# EAGLE design Touch Switch (EAGLE 6.2)
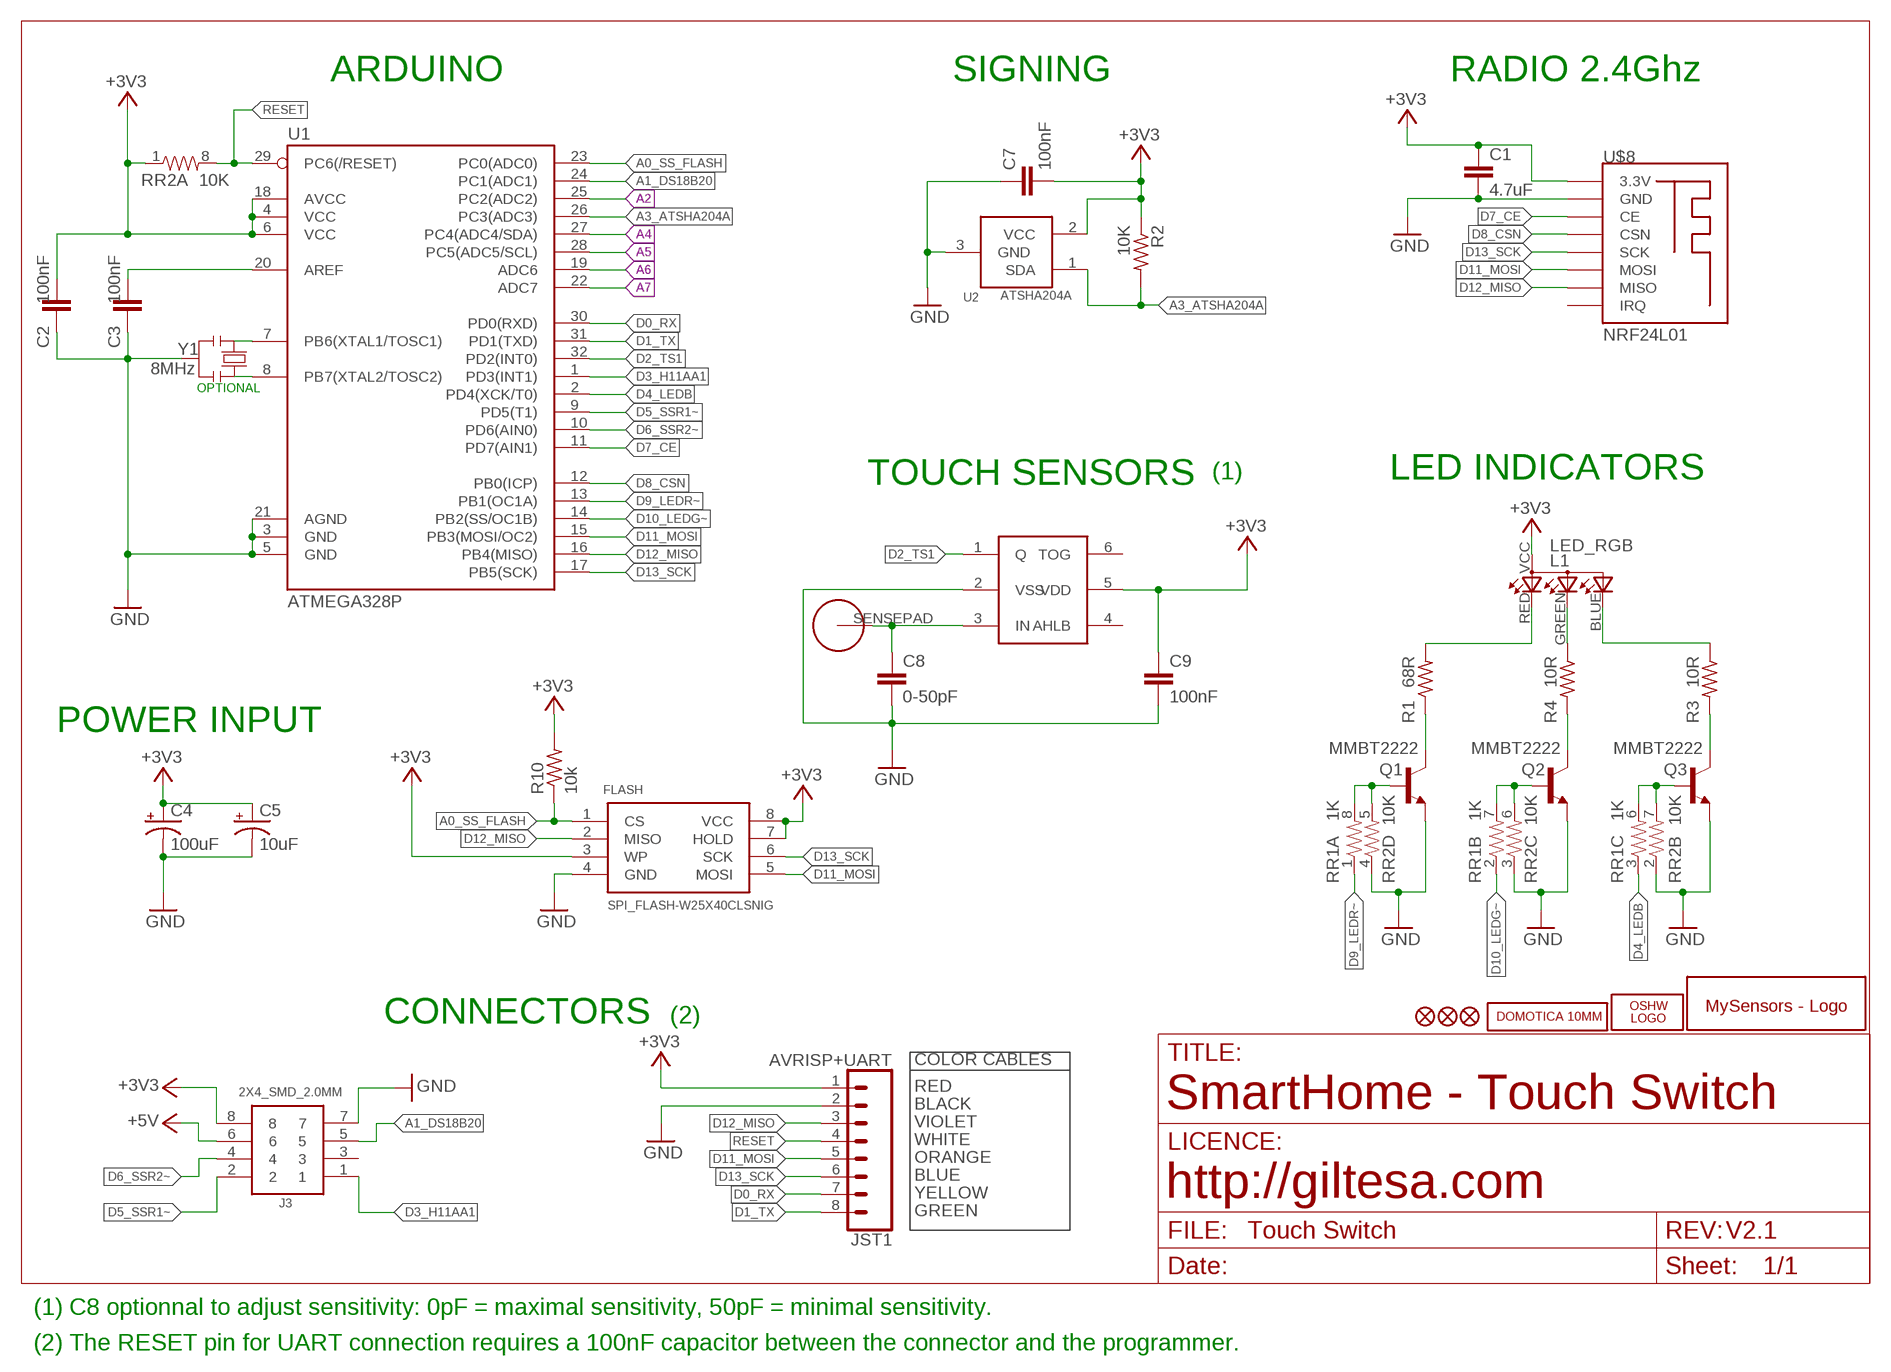
[diagram p0: schematic, sheet 1]

## Parts
C1  4.7uF  C1206  [C1206]
C2  100nF  C0603  [C0603]
C3  100nF  C0603  [C0603]
C4  100uF  10UF-16V-10%(TANT)  [EIA3216]
C5  10uF  10UF-16V-10%(TANT)  [EIA3216]
C7  100nF  C0603  [C0603]
C8  0-50pF  C0603  [C0603]
C9  100nF  C0603  [C0603]
FLASH  SPI_FLASH-W25X40CLSNIG  SPI_FLASH-X25XXSMD  [SO08]
J3  2X4_SMD_2.0MM  [2X4_SMD_2.0MM]
JST1  AVRISP+UART  JST-8-1MM-SMD  [JST-8-1MM-SMD]
L1  LED_RGB  LED_RGB_1206_SIDE  [LED_RGB_1206_SIDE]
LOGO1  OSHW_LOGO_FILLX0150-NT  [OSHW_FILLX150_NOTEXT]
Q1  MMBT2222  TRANSISTOR_NPNSOT23  [SOT23]
Q2  MMBT2222  TRANSISTOR_NPNSOT23  [SOT23]
Q3  MMBT2222  TRANSISTOR_NPNSOT23  [SOT23]
R1  68R  R0603  [R0603]
R2  10K  R0603  [R0603]
R3  10R  R0603  [R0603]
R4  10R  R0603  [R0603]
R10  10k  R0603  [R0603]
RR1  1K  RESISTOR-ARRAY0603-ARV  [0603-ARV]
RR2  10K  RESISTOR-ARRAY0603-ARV  [0603-ARV]
TTP1  TTP223  TTP223-BA6  [SOT-23-6]
U1  ATMEGA328P  ATMEGA328P_TQFP  [TQFP32-08]
U2  ATSHA204A  IC_ATSHA204A_CRYPT  [SOT23-3]
U$1  HTTM_SENSEPAD  [HTTM_SENSEPAD]
U$2  MYSENSORS  [MYSENSORS]
U$5  DOMOTICA-10MM  [DOMOTICA-10MM]
U$6  FIDUCIAL1X2  [FIDUCIAL-1X2]
U$7  FIDUCIAL1X2  [FIDUCIAL-1X2]
U$8  NRF24L01  NRF24L01_SMD  [NRF24L01_SMD]
U$14  FIDUCIAL1X2  [FIDUCIAL-1X2]
Y1  8MHz  RESONATORMU  [RESONATOR]

## Nets
+3V3: C1.1 C2.2 C4.A(+) C5.A(+) C7.2 C9.1 FLASH.3(WP) FLASH.7(HOLD) FLASH.8(VCC) J3.8 JST1.1 L1.VCC R2.1 R10.2 RR2.1 TTP1.5(VDD) U1.4(VCC) U1.6(VCC) U1.18(AVCC) U2.2(VCC) U$8.3.3V
+5V: J3.6
A0_SS_FLASH: FLASH.1(CS) R10.1 U1.23(PC0(ADC0))
A1_DS18B20: J3.5 U1.24(PC1(ADC1))
A2: U1.25(PC2(ADC2))
A3_ATSHA204A: R2.2 U1.26(PC3(ADC3)) U2.1(SDA)
A4: U1.27(PC4(ADC4/SDA))
A5: U1.28(PC5(ADC5/SCL))
A6: U1.19(ADC6)
A7: U1.22(ADC7)
D0_RX: JST1.7 U1.30(PD0(RXD))
D1_TX: JST1.8 U1.31(PD1(TXD))
D2_TS1: TTP1.1(Q) U1.32(PD2(INT0))
D3_H11AA1: J3.1 U1.1(PD3(INT1))
D4_LEDB: RR1.3 U1.2(PD4(XCK/T0))
D5_SSR1~: J3.2 U1.9(PD5(T1))
D6_SSR2~: J3.4 U1.10(PD6(AIN0))
D7_CE: U1.11(PD7(AIN1)) U$8.CE
D8_CSN: U1.12(PB0(ICP)) U$8.CSN
D9_LEDR~: RR1.1 U1.13(PB1(OC1A))
D10_LEDG~: RR1.2 U1.14(PB2(SS/OC1B))
D11_MOSI: FLASH.5(MOSI) JST1.5 U1.15(PB3(MOSI/OC2)) U$8.MOSI
D12_MISO: FLASH.2(MISO) JST1.3 U1.16(PB4(MISO)) U$8.MISO
D13_SCK: FLASH.6(SCK) JST1.6 U1.17(PB5(SCK)) U$8.SCK
GND: C1.2 C2.1 C3.1 C4.C(-) C5.C(-) C7.1 C8.2 C9.2 FLASH.4(GND) J3.7 JST1.2 Q1.2(E) Q2.2(E) Q3.2(E) RR2.2 RR2.3 RR2.4 TTP1.2(VSS) U1.3(GND) U1.5(GND) U1.21(AGND) U2.3(GND) U$8.GND Y1.2
N$1: Q1.3(C) R1.1
N$2: L1.GREEN R4.1
N$4: L1.RED R1.2
N$5: Q2.1(B) RR1.7 RR2.6
N$6: Q1.1(B) RR1.8 RR2.5
N$7: Q2.3(C) R4.2
N$8: Q3.3(C) R3.2
N$9: Q3.1(B) RR1.6 RR2.7
N$10: C8.1 TTP1.3(IN) U$1.SENSEPAD
N$11: L1.BLUE R3.1
N$29: U1.7(PB6(XTAL1/TOSC1)) Y1.1
N$30: U1.8(PB7(XTAL2/TOSC2)) Y1.3
N$33: C3.2 U1.20(AREF)
RESET: JST1.4 RR2.8 U1.29(PC6(/RESET))
Unconnected: J3.3 RR1.4 RR1.5 TTP1.4(AHLB) TTP1.6(TOG) U$8.IRQ

## Notes on the sheet
- ARDUINO | SIGNING | RADIO 2.4Ghz
- OPTIONAL
- TOUCH SENSORS | (1) | LED INDICATORS
- POWER INPUT
- CONNECTORS | (2)
- COLOR CABLES
- RED
- BLACK | SmartHome - Touch Switch
- VIOLET
- WHITE
- ORANGE
- BLUE
- YELLOW | http://giltesa.com
- GREEN
- V2.1
- (1) C8 optionnal to adjust sensitivity: 0pF = maximal sensitivity, 50pF = minimal sensitivity.
- (2) The RESET pin for UART connection requires a 100nF capacitor between the connector and the programmer.

## Library data of the parts
C1 = ,giltesa:C1206
C2 C3 C7-C9 = ,giltesa:C0603
C4 = SparkFun-Capacitors:10UF-16V-10%(TANT): CAP-00811 1206/EIA-3216 Tantalum capacitor; PROD_ID: CAP-00811; VALUE: 10uF
C5 = SparkFun-Capacitors:10UF-16V-10%(TANT): CAP-00811 1206/EIA-3216 Tantalum capacitor; PROD_ID: CAP-00811
FLASH = SparkFun-DigitalIC:SPI_FLASH-X25XX: 8pin SPI Flash series x25xx. Works with devices like W25X32 and BR25L32
J3 = ,giltesa:2X4_SMD_2.0MM
JST1 = ,giltesa:JST-8-1MM-SMD
L1 = ,giltesa:LED_RGB_1206_SIDE
LOGO1 = ohw-logo:OSHW_LOGO_FILL
Q1-Q3 = SparkFun:TRANSISTOR_NPN: Transistor NPN BJT configuration in SOT23 package. MMBT2222 is the common NPN we use. Double check BCE configuration again layout.
R1-R4 R10 = ,giltesa:R0603
RR1 RR2 = SparkFun-Passives:RESISTOR-ARRAY: Array Chip Resistor Source: RS Component / Phycomp
TTP1 = NCA_Sensors:TTP223-BA6: TTP223 touch sensor
U1 = SparkFun-DigitalIC:ATMEGA328P_TQFP; PROD_ID: IC-09069; VALUE: ATMEGA328P_TQFP
U2 = TD-MySensors:IC_ATSHA204A_CRYPT
U$1 = ,giltesa:HTTM_SENSEPAD
U$2 = ,giltesa_logos:MYSENSORS
U$5 = ,giltesa_logos:DOMOTICA-10MM
U$6 U$7 U$14 = SparkFun:FIDUCIAL: Fiducial Alignment Points Various fiducial points for machine vision alignment.
U$8 = ,giltesa:NRF24L01_SMD
Y1 = MySMD2:RESONATOR

## Net classes
1 POWER: width 0.457 mm, clearance 0.205 mm to class 0, clearance 0.254 mm

## Board
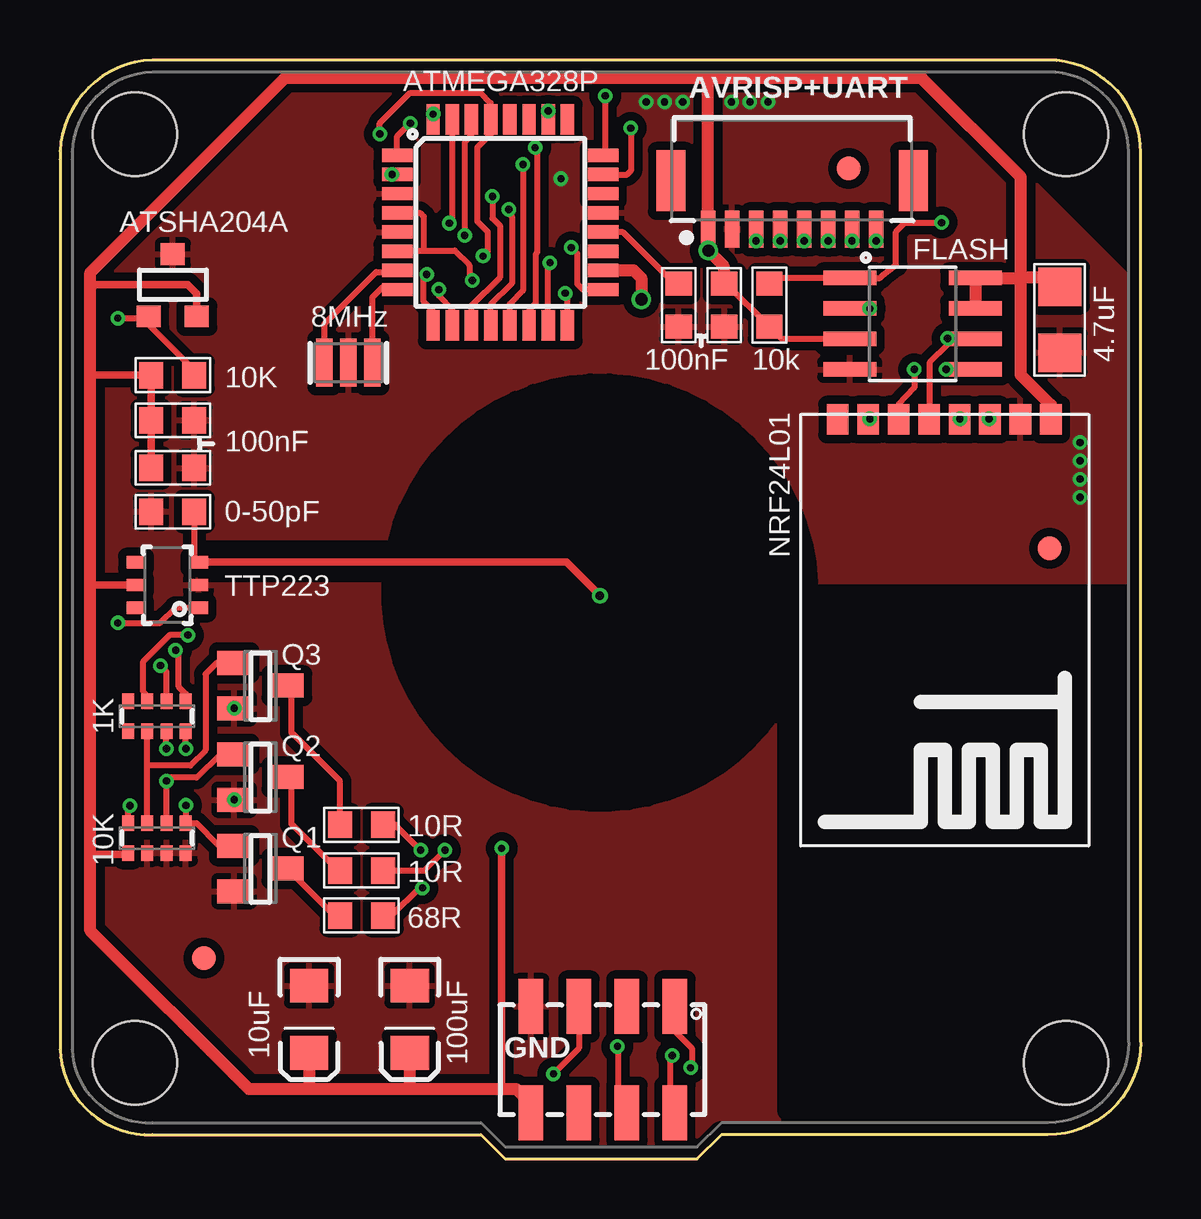
[diagram p1: board, top side]
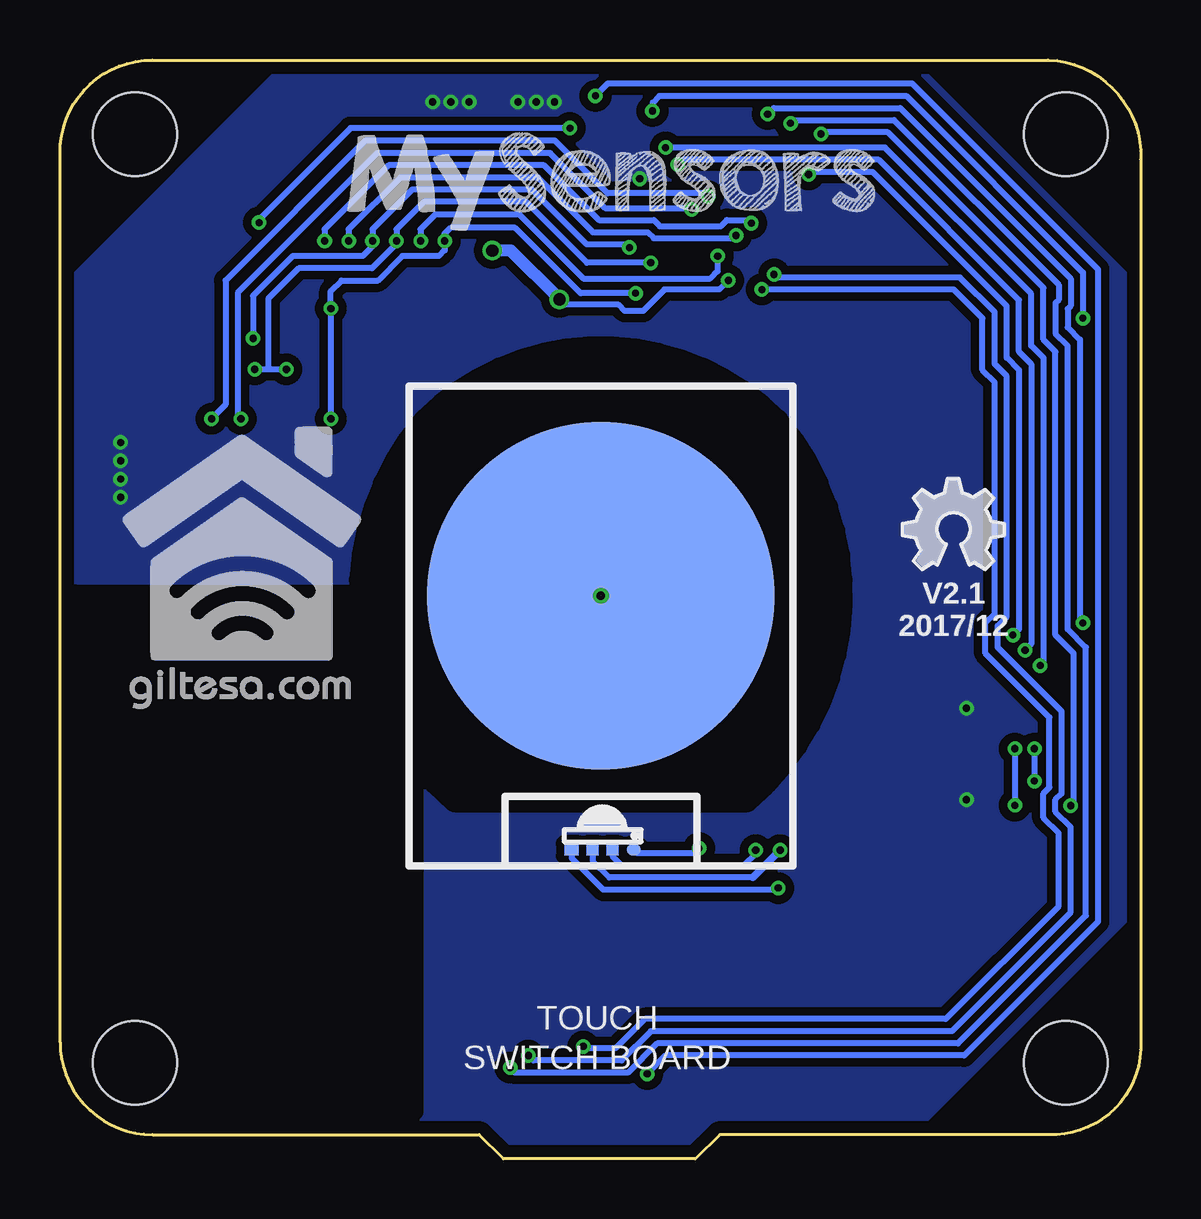
[diagram p2: board, bottom side, seen from below]

Size 45.05 x 45.81 mm. Coordinates in mm from the lower left corner, seen from the top.
Outline: 18.56,0 26.56,0 27.58,1.02 41.19,1.02 arc90 45.05,4.87 45.05,41.96 arc90 41.19,45.81 3.86,45.81 arc90 0,41.66 0,4.57 arc90 3.86,1.02 17.55,1.02 18.56,0
Copper layers (1*16): Top 0.035mm / dielectric 1.6mm / Bottom 0.035mm
Design rules "default *": minimum track width 6mil, minimum drill 0.3mm, track to track 6mil, track to pad 6mil, pad to pad 6mil, via to via 8mil, smd to smd 0mil, copper to edge 20mil, drill to drill 10mil, minimum pad ring 6mil, minimum via ring 6mil, stop-mask expansion 0mil, vias tented up to drill 100mil, thermal gap 10mil
Holes 3.5 mm at 3.12,4.01 41.93,42.72 3.12,42.72 41.93,4.01
tRestrict: area 13.9,14.9 to 31.1,32.3; area 6.1,24.4 to 13.8,25.4; area 30.3,2 to 44.4,23.5
bRestrict: area 12.5,14.9 to 32.6,33.8; area 30.3,2 to 44.4,23.5

### Footprints (pad centres in the part's own frame; a part is rotated, then mirrored left to right if it is on the bottom)
C1206 = smd 1.6 x 1.8: 1 -1.362,-0.013; 2 1.387,-0.013
C0603 = smd 1 x 1.1: 1 -0.901,-0.038; 2 0.901,-0.038
EIA3216 = smd 1.4 x 1.6: A 1.4,0; C -1.4,0
SO08 = smd 0.61 x 2.21: 1 -1.905,-2.616; 2 -0.635,-2.616; 3 0.635,-2.616; 4 1.905,-2.616; 5 1.905,2.616; 6 0.635,2.616; 7 -0.635,2.616; 8 -1.905,2.616
2X4_SMD_2.0MM = smd 2.286 x 1.016: 1 -2.213,2.976; 2 2.212,2.976; 3 -2.213,0.976; 4 2.212,0.976; 5 -2.213,-1.024; 6 2.212,-1.024; 7 -2.213,-3.024; 8 2.212,-3.024
JST-8-1MM-SMD = smd 0.6 x 1.55: 1 -3.5,0; 2 -2.5,0; 3 -1.5,0; 4 -0.5,0; 5 0.5,0; 6 1.5,0; 7 2.5,0; 8 3.5,0 | smd 1.219 x 2.54: P$9 5.054,2.017; P$10 -5.054,2.017
LED_RGB_1206_SIDE = smd 0.5 x 0.5: BLUE -0.419,-0.83; GREEN 0.414,-0.83 | smd 0.6 x 0.5: RED -1.296,-0.83; VCC 1.295,-0.83
SOT23 = smd 1 x 1.4: 1 -0.95,-1.1; 2 0.95,-1.1; 3 0,1.1
R0603 = smd 1 x 1.1: 1 -0.901,0.013; 2 0.901,0.013
0603-ARV = smd 0.5 x 0.65: 1 -1.2,-0.625; 2 -0.4,-0.625; 3 0.4,-0.625; 4 1.2,-0.625; 5 1.2,0.625; 6 0.4,0.625; 7 -0.4,0.625; 8 -1.2,0.625
SOT-23-6 = smd 0.51 x 0.8: 1 0.955,-0.03; 2 1.905,-0.03; 3 2.855,-0.03; 4 2.855,2.57; 5 1.905,2.57; 6 0.955,2.57
TQFP32-08 = smd 1.27 x 0.559: 1 -4.293,2.8; 2 -4.293,2; 3 -4.293,1.2; 4 -4.293,0.4; 5 -4.293,-0.4; 6 -4.293,-1.2; 7 -4.293,-2; 8 -4.293,-2.8; 17 4.293,-2.8; 18 4.293,-2; 19 4.293,-1.2; 20 4.293,-0.4; 21 4.293,0.4; 22 4.293,1.2; 23 4.293,2; 24 4.293,2.8 | smd 0.559 x 1.27: 9 -2.8,-4.293; 10 -2,-4.293; 11 -1.2,-4.293; 12 -0.4,-4.293; 13 0.4,-4.293; 14 1.2,-4.293; 15 2,-4.293; 16 2.8,-4.293; 25 2.8,4.293; 26 2,4.293; 27 1.2,4.293; 28 0.4,4.293; 29 -0.4,4.293; 30 -1.2,4.293; 31 -2,4.293; 32 -2.8,4.293
SOT23-3 = smd 1 x 0.9: 1 -1,-1.3; 2 1,-1.3; 3 0,1.3
HTTM_SENSEPAD = smd 14.5 x 14.5: SENSEPAD -0.001,0.001
FIDUCIAL-1X2 = smd 1 x 1: 1 0,0
NRF24L01_SMD = smd 0.9 x 1.27: 3.3V 1.575,0.203; CE 4.115,0.203; CSN 5.385,0.203; GND 2.845,0.203; IRQ 10.465,0.203; MISO 9.195,0.203; MOSI 7.925,0.203; SCK 6.655,0.203
RESONATOR = smd 0.7 x 2: 1 -1,0; 2 0,0; 3 1,0

### Placement (x,y rotation side)
C1  41.69,35 270 top
C2  27.65,35.59 90 top
C3  25.75,35.59 90 top
C4  14.58,5.83 270 top
C5  10.38,5.83 270 top
C7  4.7,30.75 180 top
C8  4.7,26.94 180 top
C9  4.7,28.85 0 top
FLASH  35.54,34.82 270 top
J3  22.66,4.15 270 top
JST1  30.52,38.76 0 top
L1  22.43,13.73 0 bottom
LOGO1  9.93,24.56 0 bottom
Q1  8.36,12.11 270 top
Q2  8.36,15.92 270 top
Q3  8.36,19.73 270 top
R1  12.57,10.14 0 top
R2  4.7,32.66 0 top
R3  12.57,13.95 180 top
R4  12.57,12.04 180 top
R10  29.56,35.59 270 top
RR1  4.04,18.46 180 top
RR2  4.04,13.38 0 top
TTP1  5.74,22.02 90 top
U1  18.35,39.04 0 top
U2  4.7,36.42 0 top
U$1  22.5,23.48 0 bottom
U$2  33.05,38.5 0 bottom
U$5  42.46,18.69 0 bottom
U$6  41.25,25.45 0 top
U$7  32.87,41.3 0 top
U$8  42.88,31.03 180 top
U$14  6,8.38 0 top
Y1  12.02,33.19 0 top

### Tracks (layer width: path | path; a pad name or v marks a point on that pad's centre or on a via)
+3V3  (via drill 0.3, 0.51)
  Top 0.254: U1.6 14.09,37.87 15.16,37.87 | v17.19,36.62 17.06,36.75 17.06,37.26 16.45,37.87 15.16,37.87 | U1.4 15.01,39.44 15.16,39.29 15.16,37.87 | C2.2 27.77,36.49 R10.2 | 29.95,34.31 R10.2 | FLASH.3 30.08,34.18 R10.2
  Top 0.305: RR2.1 2.78,12.7 1.27,12.7 | TTP1.5 1.34,23.93 1.27,24 | C9.1 C7.2 R2.1 1.35,32.67 1.27,32.76 | U2.2 5.7,36.07 5.33,36.44 1.39,36.44 1.27,36.32 | v18.41,12.95 18.41,2.99 18.33,2.92
  Top 0.508: C2.2 27.65,37.24 v27.03,37.87 | 29.77,34.74 R10.2 | 26.84,45.08 9.39,45.08 1.27,36.95 1.27,36.32 1.27,32.76 1.27,24 1.27,12.7 1.27,9.52 7.87,2.92 10.33,2.92 | 26.84,45.08 35.91,45.08 40.05,40.94 40.05,36.88 | 10.33,2.92 14.52,2.92 | 14.52,2.92 18.33,2.92 19.02,2.92 19.48,2.46 19.48,2.09 J3.8 | C5.A 10.38,2.97 10.33,2.92 | C4.A 14.58,2.97 14.52,2.92 | 26.84,45.08 27.02,45.03 JST1.1 27.02,38.51 v27.03,37.87 | U$8.3.3V 41.3,31.43 40.05,32.69 40.05,36.62 | 41.68,36.34 C1.1 41.57,36.26 41.57,36.24 41.07,36.75 40.18,36.75 40.05,36.88 | FLASH.7 FLASH.8 39.95,36.72 40.05,36.62 | 40.05,36.62 40.05,36.88 | v24.23,35.84 24.23,36.72 23.92,37.04 U1.18 | 27.02,38.64 v27.03,37.87
  Bottom 0.254: v18.41,12.95 18.39,12.95 18.59,12.75 20.98,12.75 L1.VCC | v17.19,36.62 17.57,36.24 19.86,36.24 20.75,35.35 21.51,35.35 21.76,35.61 24,35.61 v24.23,35.84
  Bottom 0.508: v24.23,35.84 26.27,37.87 v27.03,37.87
A0_SS_FLASH  (via drill 0.3)
  Top 0.254: U1.23 23.64,41.04 23.8,41.19 v23.8,42.97 | v36.75,39.03 35.22,39.03 34.84,38.65 34.84,37.26 34.31,36.85 34.18,36.72 FLASH.1 29.8,36.72 R10.1
  Bottom 0.254: v23.8,42.97 32.94,42.97 36.75,39.16 v36.75,39.03
A1_DS18B20  (via drill 0.3)
  Top 0.254: v22.73,44.32 22.73,41.92 U1.24 | J3.5 21.63,4.61 v20.57,3.55
  Bottom 0.254: v22.73,44.32 22.22,44.83 9.52,44.83 1.77,37.08 1.77,9.9 7.36,4.31 19.81,4.31 v20.57,3.55
A3_ATSHA204A  (via drill 0.3)
  Top 0.254: R2.2 5.31,32.9 5.31,33.17 3.7,34.78 U2.1 3.63,35.05 v2.41,35.05 | U1.26 20.35,43.65 v20.35,43.68
  Bottom 0.254: v20.35,43.68 20.34,44.04 20.06,44.32 9.78,44.32 2.41,36.95 v2.41,35.05
D0_RX  (via drill 0.3)
  Top 0.254: v16.87,38.5 16.89,38.52 16.89,42.41 17.14,42.67 U1.30 | v33.02,38.27 33.07,38.71 JST1.7
  Bottom 0.254: v16.87,38.5 16.99,38.38 20.3,38.38 20.55,38.63 22.84,38.63 25.12,40.91 30.86,40.91 JST1.7 33.02,38.32 v33.02,38.27
D1_TX  (via drill 0.3)
  Top 0.254: U1.31 16.35,39.13 v16.23,39.01 | v34.02,38.27 34.01,38.69 JST1.8
  Bottom 0.254: v16.23,39.01 16.36,39.14 17.25,39.14 17.5,38.88 20.04,38.88 20.3,39.14 22.58,39.14 24.87,41.42 31.35,41.42 JST1.8 34.02,38.34 v34.02,38.27
D2_TS1  (via drill 0.3)
  Top 0.254: U1.32 15.55,43.37 v15.55,43.56 | v2.41,22.35 4.19,22.35 4.82,22.98 TTP1.1
  Bottom 0.254: v15.55,43.56 15.3,43.81 10.03,43.81 2.92,36.7 2.92,35.55 3.04,35.43 3.04,34.67 2.54,34.16 2.54,22.47 v2.41,22.35
D3_H11AA1  (via drill 0.3)
  Top 0.254: U1.1 14.06,42.63 v14.6,43.17 | J3.1 25.52,7.15 25.52,5.43 26.34,4.62 26.34,3.86 v26.29,3.81
  Bottom 0.254: v14.6,43.17 14.47,43.3 10.28,43.3 3.42,36.44 3.42,35.81 3.55,35.68 3.55,34.41 3.04,33.9 3.04,22.09 2.28,21.33 2.28,10.15 7.62,4.82 20.16,4.82 21.38,3.6 26.08,3.6 v26.29,3.81
D4_LEDB  (via drill 0.3)
  Top 0.254: U1.2 13.74,41.04 v13.84,41.04 | v5.33,21.84 4.57,21.84 3.47,20.75 3.47,19.48 3.64,19.31 RR1.3
  Bottom 0.254: v13.84,41.04 13.74,41.14 11.17,41.14 5.58,35.55 5.58,33.4 5.08,32.89 5.08,22.09 v5.33,21.84
D5_SSR1~  (via drill 0.3)
  Top 0.254: J3.2 25.63,2.15 25.45,2.33 25.45,4.24 v25.52,4.31 | U1.9 15.54,34.76 15.54,35.35 15.16,35.73 15.16,36.75 v15.29,36.88
  Bottom 0.254: v25.52,4.31 25.32,4.11 21.64,4.11 20.42,5.33 7.87,5.33 2.92,10.28 2.92,13.84 3.55,14.47 3.55,14.98 3.3,15.23 3.3,18.66 5.96,21.33 5.96,22.22 5.58,22.6 5.58,32.63 6.09,33.14 6.09,35.3 7.54,36.75 15.16,36.75 v15.29,36.88
D6_SSR2~  (via drill 0.3)
  Top 0.254: J3.4 23.63,1.99 23.29,2.33 23.29,4.62 v23.24,4.69 | v15.79,36.24 15.79,35.99 16.35,35.43 U1.10
  Bottom 0.254: v23.24,4.69 23.29,4.62 21.89,4.62 20.67,5.84 8.12,5.84 3.42,10.54 3.42,13.58 4.06,14.22 4.06,15.23 3.81,15.49 3.81,18.41 6.47,21.08 6.47,22.35 6.09,22.73 6.09,32.38 6.6,32.89 6.6,35.05 7.79,36.24 v15.79,36.24
D7_CE  (via drill 0.3)
  Top 0.254: U1.11 17.14,35.55 18.33,36.75 18.33,38.91 18.03,39.21 v18.03,40.13 | v38.73,30.86 U$8.CE
  Bottom 0.254: v18.03,40.13 18.16,40.25 22.22,40.25 24.43,42.46 32.3,42.46 38.15,36.62 38.15,31.44 v38.73,30.86
D8_CSN  (via drill 0.3)
  Top 0.254: U1.12 17.95,35.61 18.84,36.49 18.84,39.29 18.71,39.42 v18.71,39.58 | v37.51,30.86 v37.51,30.85 U$8.CSN
  Bottom 0.254: v37.51,30.86 37.64,30.98 37.64,36.11 31.82,41.93 24.61,41.93 22.33,39.65 20.04,39.65 18.77,39.65 v18.71,39.58
D9_LEDR~  (via drill 0.3)
  Top 0.254: U1.13 18.75,35.64 19.3,36.19 v19.3,41.46 | RR1.1 5.24,19.39 4.95,19.68 4.95,21.08 v4.82,21.2
  Bottom 0.254: v4.82,21.2 4.57,21.46 4.57,33.14 5.08,33.65 5.08,35.81 10.92,41.65 19.11,41.65 v19.3,41.46
D10_LEDG~  (via drill 0.3)
  Top 0.254: RR1.2 4.44,20.32 v4.19,20.57 | v19.81,42.16 19.88,42.09 19.88,37.77 19.83,37.71 19.83,35.66 19.55,35.38 U1.14
  Bottom 0.254: v19.81,42.16 10.66,42.16 4.57,36.06 4.57,33.9 4.06,33.4 4.06,20.7 v4.19,20.57
D11_MOSI  (via drill 0.3)
  Top 0.254: FLASH.5 v36.93,32.91 | U$8.MOSI 34.95,31.44 35.61,32.15 v35.61,32.91 | U1.15 20.35,37.29 v20.42,37.36 | v31.02,38.27 31.03,38.74 JST1.5
  Bottom 0.254: v20.42,37.36 23.09,37.36 25.63,39.9 29.88,39.9 JST1.5 31.02,38.29 v31.02,38.27 31.02,38.16 32.05,37.13 35.1,37.13 36.37,35.86 36.37,32.91 | 36.37,32.91 v35.61,32.91 35.61,32.79 | 36.37,32.91 v36.93,32.91
D12_MISO  (via drill 0.3)
  Top 0.254: U1.16 21.15,35.99 v21.06,36.09 | v33.76,35.45 FLASH.2 | v33.76,30.86 U$8.MISO | v29.02,38.27 29,38.74 JST1.3
  Bottom 0.254: v21.06,36.09 23.34,36.09 26.07,38.82 28.77,38.82 29.02,38.56 29.02,38.29 v29.02,38.27 29.02,37.88 29.26,37.64 30.78,37.64 31.8,36.62 33.32,36.62 33.76,36.18 v33.76,35.45 v33.76,30.86
D13_SCK  (via drill 0.3)
  Top 0.254: U1.17 21.8,36.24 21.57,36.47 21.57,37.74 v21.31,37.99 | v32.02,38.27 32.05,38.73 JST1.6 | U$8.SCK 36.27,30.85 36.27,33.22 37,33.95 v37,34.21 37.03,34.18 FLASH.6
  Bottom 0.254: v21.31,37.99 21.44,38.12 23.09,38.12 25.38,40.41 30.37,40.41 JST1.6 32.02,38.3 v32.02,38.27 32.02,38.04 32.43,37.64 35.35,37.64 37,35.99 v37,34.21
GND  (via drill 0.3)
  other vias: 42.52,29.87 42.52,29.1 42.52,28.34 42.52,27.58 7.27,18.79 7.27,14.98 20.88,40.86 27.99,44.06 28.75,44.06 29.52,44.06 25.96,44.06 25.2,44.06 24.44,44.06
  pour Bottom (isolate 0.356): 9.83,46.15 35.22,46.15 45.26,36.11 45.26,10.71 35.22,0.68 27.73,0.68 26.72,-0.33 18.33,-0.33 17.32,0.68 9.83,0.68 -0.21,10.71 -0.21,36.11
  pour Top (isolate 0.356): 9.83,46.15 35.22,46.15 45.26,36.11 45.26,10.71 35.22,0.68 27.73,0.68 26.72,-0.33 18.33,-0.33 17.32,0.68 9.83,0.68 -0.21,10.71 -0.21,36.11
N$1
  Top 0.254: R1.1 11.42,10.15 Q1.3
N$2  (via drill 0.3)
  Top 0.254: R4.1 15.2,12.03 v16.05,12.87
  Bottom 0.254: v16.05,12.87 16.05,12.75 16.56,12.24 21.64,12.24 22.02,12.62 L1.GREEN
N$4  (via drill 0.3)
  Top 0.254: R1.2 13.83,10.15 14.98,11.3 v15.11,11.3
  Bottom 0.254: v15.11,11.3 15.19,11.22 22.4,11.22 23.73,12.55 L1.RED
N$5  (via drill 0.3)
  Top 0.254: Q2.1 6.67,16.87 5.69,15.9 4.57,15.9 v4.43,15.76 RR2.6 4.48,14.05 | v4.43,17.1 RR1.7
  Bottom 0.254: v4.43,17.1 v4.43,15.76
N$6  (via drill 0.3)
  Top 0.254: Q1.1 6.62,13.06 5.69,13.99 5.13,13.99 RR2.5 5.25,13.89 v5.25,14.74 | v5.25,17.1 RR1.8
  Bottom 0.254: v5.25,17.1 v5.25,14.74
N$7
  Top 0.254: 11.58,12.03 9.65,13.96 9.65,15.73 Q2.3
  Top 0.406: R4.2 11.58,12.03
N$8
  Top 0.254: R3.2 11.67,15.76 9.65,17.77 9.65,19.54 Q3.3
N$9
  Top 0.254: RR2.7 3.64,16.4 | 3.64,16.4 RR1.6 | Q3.1 6.54,20.68 6.07,20.21 6.07,17.04 5.44,16.4 3.64,16.4
N$10  (via drill 0.36)  (1 unrouted)
  Top 0.254: 5.55,24.88 TTP1.3 5.6,25.05 C8.1
  Top 0.305: TTP1.3 21.11,24.88 v22.5,23.48
  Bottom 0.127: v22.5,23.48
N$11  (via drill 0.3)
  Top 0.254: R3.1 13.97,13.93 v15.03,12.87
  Bottom 0.254: 16.18,11.73 22.14,11.73 22.85,12.44 L1.BLUE
  Bottom 0.305: v15.03,12.87 16.18,11.73
N$29
  Top 0.254: Y1.1 11.02,34.81 13.18,36.98 14.14,36.98 | 14.14,36.98 14.45,36.98 | U1.7 14.12,37.1 14.12,36.99 14.14,36.98
N$30
  Top 0.254: Y1.3 13.02,35.93 13.44,36.34 13.96,36.34 U1.8
N$33
  Top 0.254: C3.2 25.66,36.44 23.47,38.63 U1.20
RESET  (via drill 0.3, 0.3 pad 0.53)
  Top 0.254: RR2.8 2.84,14.65 v2.92,14.73 | v13.33,42.73 13.33,43.17 14.6,44.45 17.52,44.45 17.95,44.01 U1.29 17.95,42.72 17.39,42.16 17.39,39.09 17.83,38.65 17.83,37.83 v17.64,37.64 | v30.02,38.27 JST1.4
  Bottom 0.254: v2.92,14.73 2.79,14.85 2.79,21.08 3.55,21.84 3.55,33.65 4.06,34.16 4.06,36.32 10.54,42.79 13.27,42.79 v13.33,42.73 | v17.64,37.64 17.64,37 17.94,36.7 23.24,36.7 25.9,39.37 29.41,39.37 JST1.4 v30.02,38.27

### Text on the board
tPlace: GND
bPlace: V2.1 | 2017/12 | TOUCH | SWITCH BOARD